# EAGLE schematic Shield (EAGLE 9.6.0)
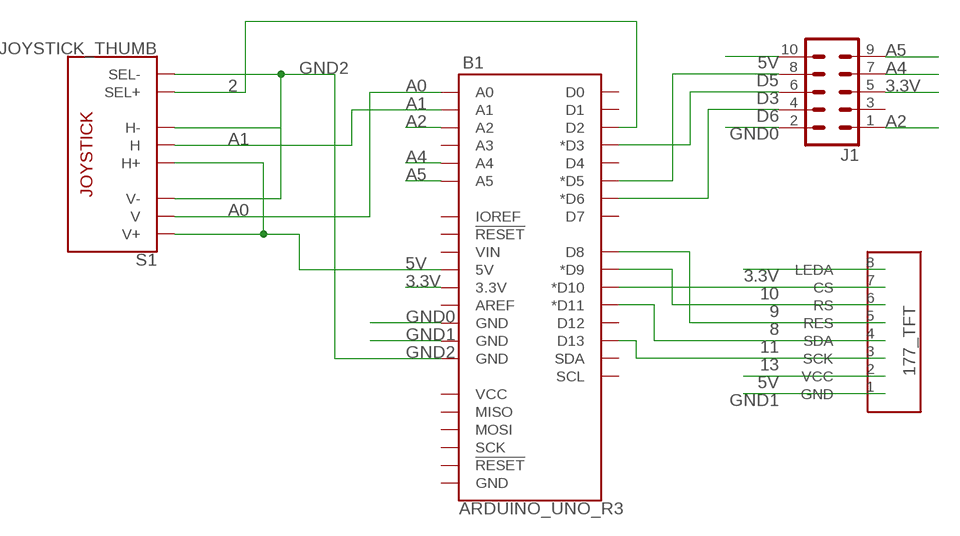
[diagram p0: schematic, sheet 1]

## Parts
1.77_TFT  TFT_DISPL_1.77"  [TFT_DISP]
B1  ARDUINO_UNO_R3  [ARDUINO_R3]
J1  CONN_05X2SHD  [2X5-SHROUDED]
S1  JOYSTICK_THUMB  [JOYSTICK]

## Nets
2: B1.D2 S1.B1A(SEL+)
3.3V: 1.77_TFT.8(LEDA) B1.3.3V J1.5
5V: 1.77_TFT.2(VCC) B1.5V J1.10 S1.H1(H+) S1.V1(V+)
8: 1.77_TFT.5(RES) B1.D8
9: 1.77_TFT.6(RS) B1.D9(*D9)
10: 1.77_TFT.7(CS) B1.D10(*D10)
11: 1.77_TFT.4(SDA) B1.D11(*D11)
13: 1.77_TFT.3(SCK) B1.D13
A0: B1.A0 S1.V2(V)
A1: B1.A1 S1.H2(H)
A2: B1.A2 J1.1
A4: B1.A4 J1.7
A5: B1.A5 J1.9
D3: B1.D3(*D3) J1.6
D5: B1.D5(*D5) J1.8
D6: B1.D6(*D6) J1.4
GND0: B1.GND@4(GND) J1.2
GND1: 1.77_TFT.1(GND) B1.GND@3(GND)
GND2: B1.GND@2(GND) S1.B2A(SEL-) S1.H3(H-) S1.V3(V-)
Unconnected: B1.A3 B1.AREF B1.D0 B1.D1 B1.D4 B1.D7 B1.D12 B1.GND@1(GND) B1.IOREF B1.MISO B1.MOSI B1.RESET@1(!RESET!) B1.RESET@2(!RESET!) B1.SCK B1.SCL B1.SDA B1.VCC B1.VIN J1.3

## Library data of the parts
1.77_TFT = ChopstixComponents:TFT_DISPL_1.77"
B1 = SparkFun-Boards:ARDUINO_UNO_R3: Arduino R3 Footprint with SPI header Arduino Uno R3 Compatible Footprint. Matches PCB size of the original board. SparkFun Products: SAMD21 Dev Breakout <https://www.sparkfun.com/products/13672> RedBoard <https://www.sparkfun.com/products/12757> R3 Stackable Headers <https://www.sparkfun.com/products/11417>
J1 = SparkFun-Connectors:CONN_05X2: Multi connection point. Often used as Generic Header-pin footprint for 0.1 inch spaced/style header connections For AVR SPI programming port, see special device with nice symbol: "AVR_SPI_PROG_5x2.dev" You can populate with any combo of single row headers, but if you'd like an exact match, check these: 2x5 AVR ICSP Male Header <https://www.sparkfun.com/products/778> (PRT-00778) 2x5 Pin Shrouded Header <https://www.sparkfun.com/products/8506> (PRT-08506) On any of the 0.1 inch spaced packages, you can populate with these: Break Away Headers - Straight <https://www.sparkfun.com/products/116> (PRT-00116) Break Away Male Headers - Right Angle <https://www.sparkfun.com/products/553> (PRT-00553) Female Headers <https://www.sparkfun.com/products/115> (PRT-00115) Break Away Headers - Machine Pin <https://www.sparkfun.com/products/117> (PRT-00117) Break Away Female Headers - Swiss Machine Pin <https://www.sparkfun.com/products/743> (PRT-00743) Special note: the shrouded connector mates well with our 5x2 ribbon cables: 2x5 Pin IDC Ribbon Cable <https://www.sparkfun.com/products/8535> (PRT-08535); PROD_ID: CONN-08671; SF_ID: PRT-08506
S1 = SparkFun-Switches:JOYSTICK_THUMB: Analog Thumb Joystick This is a joystick very similar to the ‘analog’ joysticks on PS2 (PlayStation 2) controllers. Directional movements are simply two potentiometers - one for each axis. Pots are ~10k each. This joystick also has a select button that is actuated when the joystick is pressed down. SparkFun Products Thumb Joystick <https://www.sparkfun.com/products/9032> (COM-09032) SparkFun Thumb Joystick Breakout <https://www.sparkfun.com/products/9110> (BOB-09110) SparkFun Joystick Shield Kit <https://www.sparkfun.com/products/9760> (DEV-09760); PROD_ID: COMP-09744; SF_SKU: COM-09032